# Altium schematic sheet 3.3-5 and 5-3.3 Level Shifters.SchDoc
size A
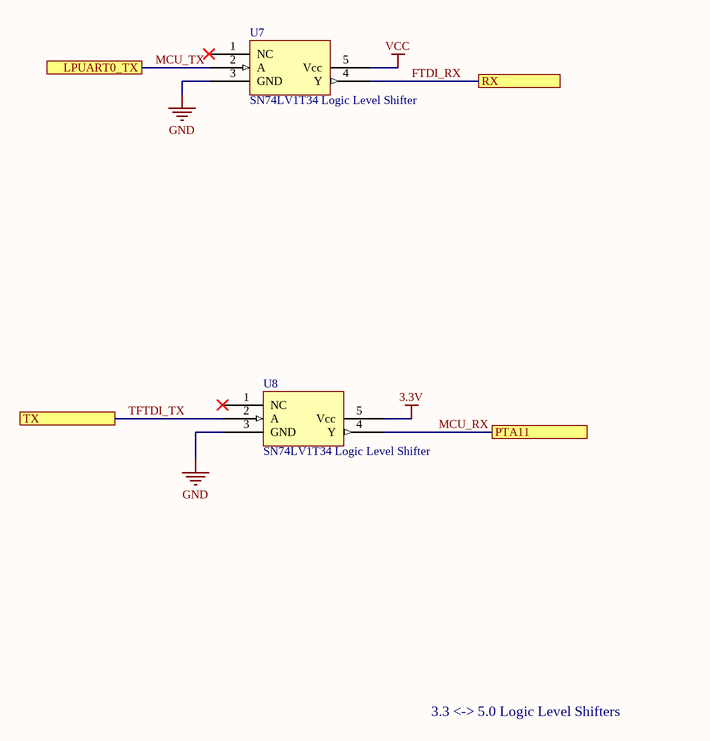
[diagram p0: 3.3-5 and 5-3.3 Level Shifters.SchDoc]

## Parts
U7  SN74LV1T34 Logic Level Shifter  [SOT23-5]
U8  SN74LV1T34 Logic Level Shifter  [SOT23-5]

## Ports
LPUART0_TX, PTA11, RX, TX

## Nets
3.3V: U8.5(Vcc)
GND: U7.3(GND) U8.3(GND)
VCC: U7.5(Vcc)
FTDI_RX: U7.4(Y) ; port RX
MCU_RX: U8.4(Y) ; port PTA11
MCU_TX: U7.2(A) ; port LPUART0_TX
TFTDI_TX: U8.2(A) ; port TX

Not connected (* = marked no-connect by the designer): U7 1(NC)*; U8 1(NC)*

## Notes on the sheet
- 3.3 <-> 5.0 Logic Level Shifters

## Library data of the parts
U7 U8 = 32: Logic Level Shifter driven by Vcc; Manufacturer_id: 1; MfrPartNo: SN74LV1T34DBVR; idIC_Misc: 32; Protocol: Null; Vin(Min): 0V; Vin(Max): Vcc + .5V; Drawer_id: 1; Name: Level Shifter; Value: N/A; Type: N/A; Num_Circuits: 1; Data_Rate: Null; Package: SOT23-5; Link: https://www.digikey.com/product-detail/en/texas-instruments/SN74LV1T34DBVR/296-37176-1-ND/4555593; ComponentLink1Description: Null; ComponentLink1URL: Null; Supplier1: DigiKey; Supplier1PartNo: 296-37176-1-ND